# Altium project Glucometer-I.C.- RF Module.PrjPcb
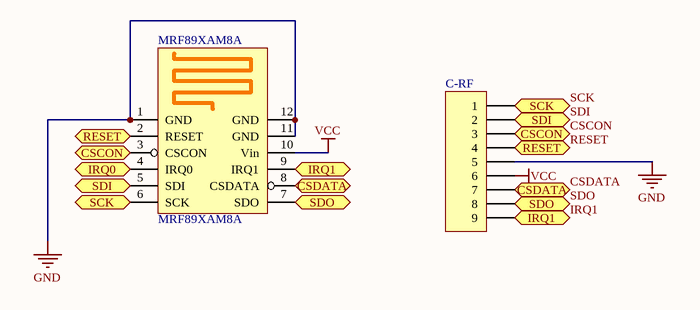
[diagram p0: Glucometer-I.C.- RF Module V2.SchDoc]
2 sheets, 5 parts. Net scope: flat (ports and power ports of the same name join across sheets).
Board files: Glucometer-I.C.- RF Module.PcbDoc, Glucometer-I.C.- RF Module V2.PcbDoc, Glucometer-I.C.- RF Module V3.PcbDoc, Glucometer-I.C.- RF Module V4.PcbDoc
Sheets:
  Glucometer-I.C.- RF Module V2.SchDoc
  Glucometer-I.C.- RF Module V4.SchDoc

## Sheet Glucometer-I.C.- RF Module V2.SchDoc
size Letter

### Parts
C-RF  Header 9  [HDR1X9]  (value not drawn)
MRF89XAM8A  MRF89XAM8A  [MRF89XAM8A]

### Ports
CSCON, CSDATA, IRQ0, IRQ1, RESET, SCK, SDI, SDO

### Nets
GND: C-RF.5 MRF89XAM8A.1(GND) MRF89XAM8A.11(GND) MRF89XAM8A.12(GND)
VCC: C-RF.6 MRF89XAM8A.10(Vin)
CSCON: C-RF.3 MRF89XAM8A.3(CSCON) ; port CSCON
CSDATA: C-RF.7 MRF89XAM8A.8(CSDATA) ; port CSDATA
IRQ1: C-RF.9 MRF89XAM8A.9(IRQ1) ; port IRQ1
RESET: C-RF.4 MRF89XAM8A.2(RESET) ; port RESET
SCK: C-RF.1 MRF89XAM8A.6(SCK) ; port SCK
SDI: C-RF.2 MRF89XAM8A.5(SDI) ; port SDI
SDO: C-RF.8 MRF89XAM8A.7(SDO) ; port SDO
NetMRF89XAM8A_4: MRF89XAM8A.4(IRQ0) ; port IRQ0

### Library data of the parts
C-RF = Header 9: Header, 9-Pin; LatestRevisionDate: 17-Jul-2002; LatestRevisionNote: Re-released for DXP Platform.; Publisher: Altium Limited
MRF89XAM8A = MRF89XAM8A: RF Module. 868MHz Ultra Low Power Sub-Ghz Transceiver Module

## Sheet Glucometer-I.C.- RF Module V4.SchDoc
size Letter
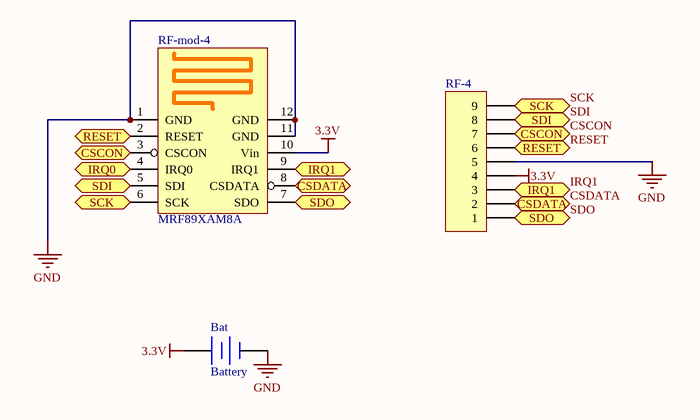
[diagram p1: Glucometer-I.C.- RF Module V4.SchDoc]

### Parts
Bat  Battery  [CR2032 Coin Holder]
RF-4  Header 9  [HDR1X9]  (value not drawn)
RF-mod-4  MRF89XAM8A  [MRF89XAM8A]

### Ports
CSCON, CSDATA, IRQ0, IRQ1, RESET, SCK, SDI, SDO

### Nets
3.3V: Bat.1(+) RF-4.4 RF-mod-4.10(Vin)
GND: Bat.2(-) RF-4.5 RF-mod-4.1(GND) RF-mod-4.11(GND) RF-mod-4.12(GND)
CSCON: RF-4.7 RF-mod-4.3(CSCON) ; port CSCON
CSDATA: RF-4.2 RF-mod-4.8(CSDATA) ; port CSDATA
IRQ1: RF-4.3 RF-mod-4.9(IRQ1) ; port IRQ1
RESET: RF-4.6 RF-mod-4.2(RESET) ; port RESET
SCK: RF-4.9 RF-mod-4.6(SCK) ; port SCK
SDI: RF-4.8 RF-mod-4.5(SDI) ; port SDI
SDO: RF-4.1 RF-mod-4.7(SDO) ; port SDO
NetMRF89XAM8A_4: RF-mod-4.4(IRQ0) ; port IRQ0

### Library data of the parts
Bat = Battery: Multicell Battery; Published: 24-Mar-1999; LatestRevisionDate: 17-Jul-2002; LatestRevisionNote: Re-released for DXP Platform.; PackageReference: BAT-2; Publisher: Altium Limited; PackageDescription: Battery; 2 Leads
RF-4 = Header 9: Header, 9-Pin; LatestRevisionDate: 17-Jul-2002; LatestRevisionNote: Re-released for DXP Platform.; Publisher: Altium Limited
RF-mod-4 = MRF89XAM8A: as MRF89XAM8A on sheet Glucometer-I.C.- RF Module V2

## Nets that join several sheets
GND: Glucometer-I.C.- RF Module V2 (C-RF.5 MRF89XAM8A.1 MRF89XAM8A.11 MRF89XAM8A.12), Glucometer-I.C.- RF Module V4 (5 pins)
CSCON: Glucometer-I.C.- RF Module V2 (C-RF.3 MRF89XAM8A.3), Glucometer-I.C.- RF Module V4 (RF-4.7 RF-mod-4.3)
CSDATA: Glucometer-I.C.- RF Module V2 (C-RF.7 MRF89XAM8A.8), Glucometer-I.C.- RF Module V4 (RF-4.2 RF-mod-4.8)
IRQ1: Glucometer-I.C.- RF Module V2 (C-RF.9 MRF89XAM8A.9), Glucometer-I.C.- RF Module V4 (RF-4.3 RF-mod-4.9)
NetMRF89XAM8A_4: Glucometer-I.C.- RF Module V2 (MRF89XAM8A.4), Glucometer-I.C.- RF Module V4 (RF-mod-4.4)
RESET: Glucometer-I.C.- RF Module V2 (C-RF.4 MRF89XAM8A.2), Glucometer-I.C.- RF Module V4 (RF-4.6 RF-mod-4.2)
SCK: Glucometer-I.C.- RF Module V2 (C-RF.1 MRF89XAM8A.6), Glucometer-I.C.- RF Module V4 (RF-4.9 RF-mod-4.6)
SDI: Glucometer-I.C.- RF Module V2 (C-RF.2 MRF89XAM8A.5), Glucometer-I.C.- RF Module V4 (RF-4.8 RF-mod-4.5)
SDO: Glucometer-I.C.- RF Module V2 (C-RF.8 MRF89XAM8A.7), Glucometer-I.C.- RF Module V4 (RF-4.1 RF-mod-4.7)